# EAGLE design czujnik_swiatla_minibord (EAGLE 6.3)
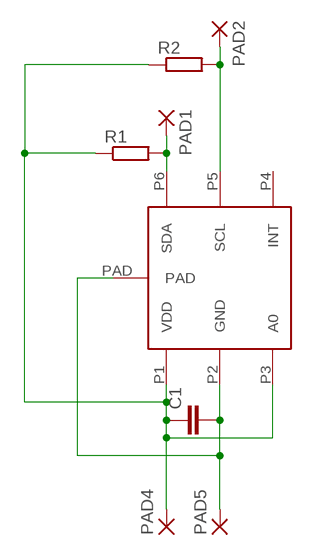
[diagram p0: schematic, sheet 1]

## Parts
C1  C-EUC0805  [C0805]
PAD1  1,6/0,8  [1,6/0,8]
PAD2  1,6/0,8  [1,6/0,8]
PAD4  1,6/0,8  [1,6/0,8]
PAD5  1,6/0,8  [1,6/0,8]
R1  R-EU_R0805  [R0805]
R2  R-EU_R0805  [R0805]
U$1  MAX44006  [6OTDFN]

## Nets
N$1: PAD2.1(P) R2.2 U$1.P5(SCL)
N$3: PAD1.1(P) R1.2 U$1.P6(SDA)
N$4: C1.1 PAD4.1(P) R1.1 R2.1 U$1.P1(VDD) U$1.P3(A0)
N$5: C1.2 PAD5.1(P) U$1.P2(GND) U$1.PAD
Unconnected: U$1.P4(INT)

## Library data of the parts
C1 = rcl:C-EU: CAPACITOR, European symbol
PAD1 PAD2 PAD4 PAD5 = wirepad:1,6/0,8: THROUGH-HOLE PAD
R1 R2 = resistor:R-EU_: RESISTOR, European symbol
U$1 = MAX44006:MAX44006

## Net classes
0 default: clearance 0.7 mm

## Board
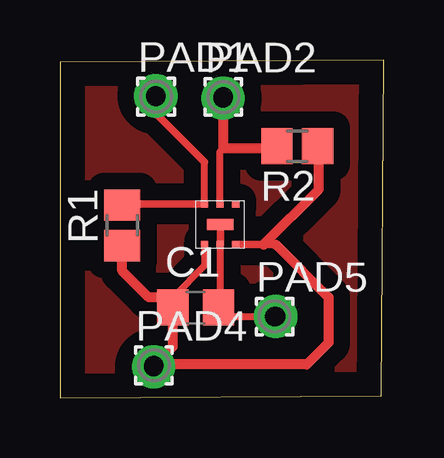
[diagram p1: board, top side]

Size 13.5 x 14.1 mm. Coordinates in mm from the lower left corner, seen from the top.
Outline: 0,0 13.4,0.1 13.5,14.1 0,14 0,0
Copper layers (1*16): Top 0.035mm / dielectric 1.5mm / Bottom 0.035mm
Design rules "default": minimum track width 10mil, minimum drill 24mil, track to track 8mil, track to pad 8mil, pad to pad 8mil, via to via 8mil, smd to smd 8mil, copper to edge 40mil, drill to drill 8mil, minimum pad ring 10mil, minimum via ring 8mil, stop-mask expansion 4mil, vias tented up to drill 0mil, thermal gap 10mil

### Footprints (pad centres in the part's own frame; a part is rotated, then mirrored left to right if it is on the bottom)
C0805 = smd 1.3 x 1.5: 1 -0.95,0; 2 0.95,0
1,6/0,8 = drill 0.813 pad 1.6 octagon: 1 0,0
R0805 = smd 1.3 x 1.5: 1 -0.85,0; 2 0.85,0
6OTDFN = smd 0.3 x 0.3: P1 -0.65,-0.845; P2 0,-0.845; P3 0.65,-0.845; P4 0.65,0.845; P5 0,0.845; P6 -0.65,0.845 | smd 1.1 x 0.45: PAD 0.01,0

### Placement (x,y rotation side)
C1  5.66,3.77 0 top
PAD1  4.01,12.57 0 top
PAD2  6.82,12.55 0 top
PAD4  3.92,1.36 0 top
PAD5  8.95,3.4 0 top
R1  2.6,7.2 90 top
R2  9.9,10.5 180 top
U$1  6.68,7.24 0 top

### Tracks (layer width: path | path; a pad name or v marks a point on that pad's centre or on a via)
N$1
  Top 0.3: U$1.P5 6.68,10.28 6.82,10.42
  Top 0.406: PAD2.1 6.82,10.42 9.05,10.42 R2.2
N$2  (via drill 0.8 pad 1.8)
  other vias: 4,12.6
N$3
  Top 0.3: U$1.P6 6.03,9.85
  Top 0.305: 6.03,9.85 4.01,11.87 | U$1.P6 2.6,8.09 R1.2
  Top 0.406: 4.01,11.87 PAD1.1
N$4
  Top 0.3: U$1.P1 6.03,5.52 4.71,4.2 C1.1
  Top 0.305: 8.5,6.39 U$1.P3 9.01,6.39 | 10.8,10.45 R2.1 | 3.96,1.4 PAD4.1
  Top 0.406: PAD4.1 4.71,2.15 C1.1 | 4.71,4.2 3.7,4.2 2.6,5.3 R1.1 | 8.5,6.39 10.8,8.7 10.8,10.45 | 9.01,6.39 11.2,4.2 11.2,2.3 10.3,1.4 3.96,1.4
N$5
  Top 0.3: U$1.P2 6.68,3.84 C1.2 6.97,3.41 PAD5.1
  Top 0.305: U$1.PAD U$1.P2
N$6  (via drill 0.8 pad 1.8)
  other vias: 6.8,12.5
N$7
  pour Top: 0,0 13.5,-0.2 13.5,14 0,14.2
N$8  (via drill 0.8 pad 1.8)
  other vias: 9,3.4
N$9  (via drill 0.8 pad 1.8)
  other vias: 3.9,1.3